# Altium schematic sheet Power.SchDoc
size A4; SheetNumber: 5; SheetTotal: 7
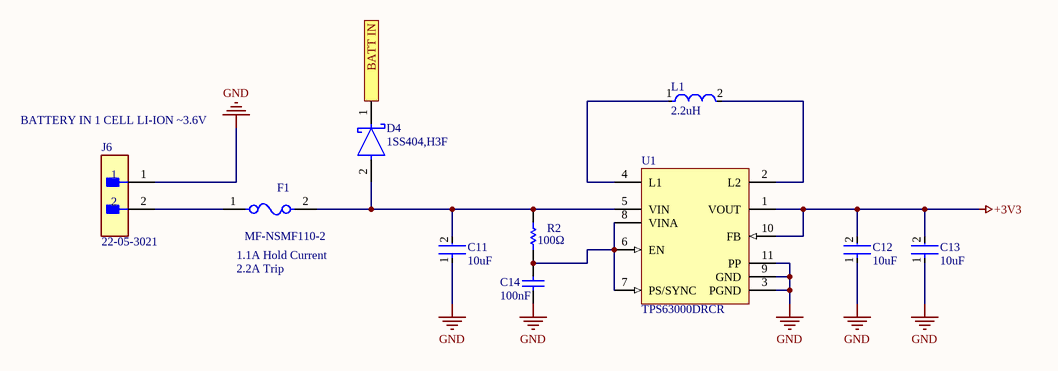
[diagram p0: Power.SchDoc]

## Parts
C11  10uF  [FP-C1608-080-IPC_A]
C12  10uF  [FP-C1608-080-IPC_A]
C13  10uF  [FP-C1608-080-IPC_A]
C14  value 100nF  [CAPC1608X10N]  (hidden comment: C0603C104M5RACTU)
D4  1SS404,H3F  [FP-SOD-323-MFG]
F1  MF-NSMF110-2  [FP-MF-NSMF110-2-MFG]
J6  22-05-3021  [FP-22-05-3021-MFG]
L1  2.2uH  [FP-IHLP-2525BD-FP_2_413x3-MFG]
R2  100Ω  [RESC1609X50X30ML8T20]
U1  TPS63000DRCR  [DRC0010J_V]

## Ports
BATT IN (see Top Level[2D], Flight_Computer[1B])

## Nets
+3V3: C12.2 C13.2 U1.1(VOUT) U1.10(FB)
GND: C11.1 C12.1 C13.1 C14.1 J6.1 U1.3(PGND) U1.9(GND) U1.11(PP)
BATT IN: D4.1(C) ; port BATT IN
NetC11_2: C11.2 D4.2(A) F1.2 R2.2 U1.5(VIN)
NetC14_2: C14.2 R2.1 U1.6(EN) U1.7(PS/SYNC) U1.8(VINA)
NetF1_1: F1.1 J6.2
NetL1_1: L1.1 U1.4(L1)
NetL1_2: L1.2 U1.2(L2)

## Notes on the sheet
- BATTERY IN 1 CELL LI-ION ~3.6V
- (near F1) 1.1A Hold Current
- 2.2A Trip

## Library data of the parts
C11-C13 = CMP-2000-05442-2: CAP CER 10UF 25V X5R 0603; Dielectric Material: Ceramic; Tolerance: 20%; Dielectric: X5R; Length: 1.6mm; Termination: SMD/SMT; Depth: 0.8mm; RoHS Compliant: Yes; Construction: Flat; Weight: 7.1E-05oz; Thickness: 0.039inch; Packaging: Tape and Reel; Min Operating Temperature: -55°C; Case Code (Imperial): 0603; Case/Package: 0603; Height: 0.8mm; Case Code (Metric): 1608; Voltage Rating: 25V; Resistor Type: Ceramic; Voltage Rating (DC): 25V; Max Operating Temperature: 85°C; REACH SVHC: No SVHC; Lead Free: Lead Free; Series: C; Width: 0.8mm; Mount: Surface Mount; Package Quantity: 1; Capacitance: 10uF
C14 = CMP-00038-5: Cap Ceramic 0.1uF 50V X7R 20% SMD 0603 125C T/R; Dissipation Factor: 2.5%; Min Operating Temperature: -55°C; Contact Plating: Tin,Matte; Height: 0.8mm; Voltage Rating: 50V; REACH SVHC: No SVHC; Max Operating Temperature: 125°C; Termination: SMD/SMT; Package Quantity: 1; Capacitance: 100nF; Packaging: Tape and Reel; Width: 0.031inch; Depth: 0.8mm; Dielectric: X7R; Tolerance: 20%; Lead Pitch: 0.7mm; Thickness: 0.034inch; Length: 1.6mm; Dielectric Material: Ceramic; Radiation Hardening: No; Voltage Rating (DC): 50V; Case/Package: 0603; Case Code (Metric): 1608; Mount: Surface Mount,PCB; Case Code (Imperial): 0603; JLC_PN: C14663
D4 = CMP-35905-000002-1: DIODE SCHOTTKY 20V 300MA USC; Max Repetitive Reverse Voltage (Vrrm): 25V; Element Configuration: Single; Mount: Surface Mount; Max Reverse Voltage (DC): 20V; Forward Current: 300mA; Packaging: Tape and Reel; Case/Package: SOD; Max Operating Temperature: 100°C; Min Operating Temperature: -40°C; Contact Plating: Tin; Average Rectified Current: 300mA
F1 = CMP-07400-000012-1: PTC RESET FUSE 6V 1.1A 1206; Manufacturer: Bourns; Trip Current: 2.2A; Current Rating: 100A; Trip Time: 0.1s; Resistance: 0.06-0.2Ω; Value: 0.06-0.2Ω; Automotive Grade: Grade 3; Category: Fuse; Digikey Description: PTC RESET FUSE 6V 1.1A 1206; RoHS: TRUE; Temperature: -40°C to +85°C; Lead Free: Yes; Temperature Range High: +85°C; Ambient Temperature Range Low: -40°C; Mouser Description: Resettable Fuses - PPTC 1.1A 6V 0.06ohm; Hold Current: 1.1A; ComponentLink2URL: https://www.bourns.com/docs/Product-Datasheets/mfnsmf.pdf; Height: 0.7mm; Device Class L2: PTC Resettable Fuses; ComponentLink2Description: Datasheet; Automotive: Yes; Ambient Temperature Range High: +85°C; Temperature Range Low: -40°C; Device Class L1: Circuit Protection; Octopart: https://octopart.com/mf-nsmf110-2-bourns-41795; Voltage Rating: 6V; Package: MF-NSMF110-2; Manufacturer Part Number: MF-NSMF110-2; Device Class L3: unset
J6 = CMP-04776-000166-1: CONN HEADER R/A 2POS 2.54MM; Glow Wire Compliant: Non-compliant; Max Current Rating: 4A; Number of Positions: 2; Contact Resistance: 10mR; Max Voltage Rating (AC): 250V; Gender: Male; Approvals: UL; Contact Material: Brass; Halogen Free: Low Halogen; Depth: 12.83mm; Color: White; Mount: Through Hole; Housing Color: White; Package Quantity: 3000; Series: KK® 7478; Packaging: Bulk; Length: 5.08mm; Fastening Type: Friction; Contact Plating: Tin; Flammability Rating: UL94 V-0; Housing Material: Nylon; Current Rating: 4A; Max Operating Temperature: 75°C; Height: 6.35mm; Lead Free: Lead Free; Pitch: 2.54mm; Termination: Solder; Min Operating Temperature: 0°C; Voltage Rating: 250V; Radiation Hardening: No; Number of Contacts: 2; Contact Mating Length: 0.264inch; Orientation: Right Angle; Contact Type: Male Pin; Number of Rows: 1; Number of Circuits: 2
L1 = CMP-02424-000562-1: Commercial Inductors, High Saturation Series 2.2uH 6.5A 34mΩ 20%; Saturation Current: 14A; Self Resonant Frequency: 5MHz; Core Material: Metal; DC Resistance (DCR): 34mR; Shielding: Shielded; Test Frequency: 100kHz; Mount: Surface Mount; Contact Plating: Tin; Inductance Tolerance: 20%; Depth: 6.72mm; Width: 0.255inch; Max DC Current: 6.5A; Height - Seated (Max): 0.094inch; Max Operating Temperature: 125°C; Case Code (Metric): 6363; RMS Current (Irms): 6.5A; Lead Free: Lead Free; Current Rating: 6.5A; Min Operating Temperature: -55°C; Package Quantity: 2000; Case/Package: 2525; Radiation Hardening: No; Military Standard: Not; Termination: SMD/SMT; Length: 7.24mm; Case Code (Imperial): 2525; Height: 2.4mm; Number of Pins: 2525; Packaging: Tape and Reel; Inductance: 2.2uH; Tolerance: 20%
R2 = CMP-2000-03824-5: Chip Resistor, 100 Ohm, +/- 1%, 100 mW,-55 to 155 degC, 0603 (1608 Metric), RoHS, Tape and Ree; Manufacturer: Vishay Semiconductor; ComponentLink2URL: http://www.vishay.com/docs/20035/dcrcwe3.pdf; ComponentLink1URL: http://www.vishay.com/; Mounting Technology: Surface Mount; ComponentLink1Description: Manufacturer URL; ComponentLink2Description: Datasheet; PackageDescription: 2-Pin Surface Mount Device, Body 1.575 x 0.85 mm; PackageReference: 0603; DatasheetVersion: 06/2012
U1 = CMP-019-00049-1: Switching Regulator, Current-mode, 0.8A, 1500kHz Switching Freq-Max, PDSO10; Frequency: 1.5MHz; Max Supply Voltage: 5.5V; Pins: 10; Min Operating Temperature: -40°C; Max Operating Temperature: 85°C; RoHS Compliant: Yes; Case/Package: HVSON